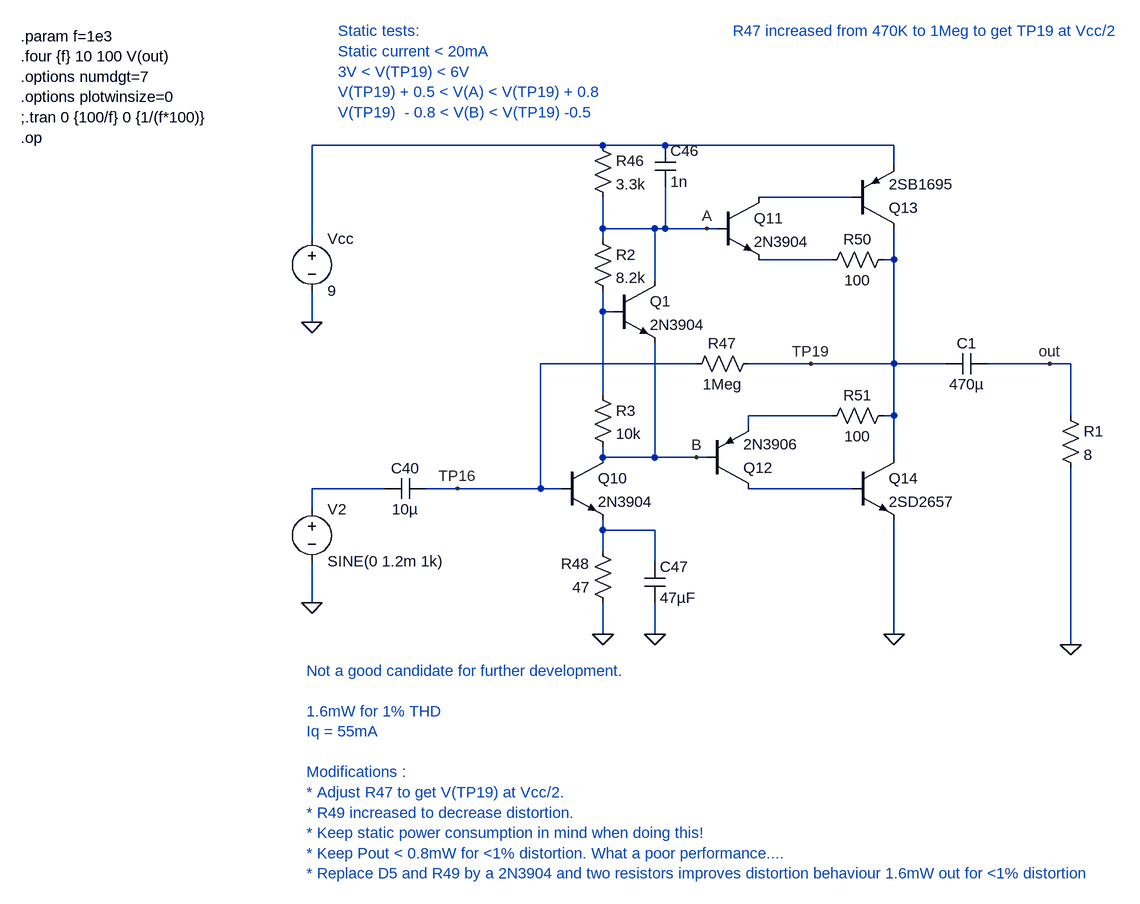
[diagram p0: schematic elenco_speaker_amp.asc]
elenco_speaker_amp.asc, the LTspice schematic file:
Version 4
SHEET 1 1332 1008
WIRE 48 -176 -400 -176
WIRE 144 -176 48 -176
WIRE 496 -176 144 -176
WIRE 496 -144 496 -176
WIRE 432 -96 288 -96
WIRE 48 -48 48 -96
WIRE 128 -48 48 -48
WIRE 144 -48 144 -112
WIRE 144 -48 128 -48
WIRE 208 -48 144 -48
WIRE 224 -48 208 -48
WIRE -400 -32 -400 -176
WIRE 48 -32 48 -48
WIRE 400 0 288 0
WIRE 496 0 496 -48
WIRE 496 0 480 0
WIRE 128 32 128 -48
WIRE 48 80 48 48
WIRE 64 80 48 80
WIRE -400 96 -400 48
WIRE 192 160 -48 160
WIRE 368 160 272 160
WIRE 496 160 496 0
WIRE 496 160 368 160
WIRE 576 160 496 160
WIRE 736 160 640 160
WIRE 768 160 736 160
WIRE 48 208 48 80
WIRE 400 240 272 240
WIRE 496 240 496 160
WIRE 496 240 480 240
WIRE 768 240 768 160
WIRE 272 256 272 240
WIRE 48 304 48 288
WIRE 128 304 128 128
WIRE 128 304 48 304
WIRE 192 304 128 304
WIRE 208 304 192 304
WIRE 496 304 496 240
WIRE -288 352 -400 352
WIRE -176 352 -224 352
WIRE -48 352 -48 160
WIRE -48 352 -176 352
WIRE -16 352 -48 352
WIRE 432 352 272 352
WIRE -400 384 -400 352
WIRE 48 416 48 400
WIRE 128 416 48 416
WIRE 48 448 48 416
WIRE 128 464 128 416
WIRE -400 528 -400 464
WIRE 48 576 48 528
WIRE 128 576 128 528
WIRE 496 576 496 400
WIRE 768 592 768 320
FLAG -400 96 0
FLAG -400 528 0
FLAG 48 576 0
FLAG 128 576 0
FLAG 496 576 0
FLAG -176 352 TP16
FLAG 368 160 TP19
FLAG 208 -48 A
FLAG 192 304 B
FLAG 768 592 0
FLAG 736 160 out
SYMBOL npn 224 -96 R0
SYMATTR InstName Q11
SYMATTR Value 2N3904
SYMBOL npn -16 304 R0
SYMATTR InstName Q10
SYMATTR Value 2N3904
SYMBOL npn 432 304 R0
SYMATTR InstName Q14
SYMATTR Value 2SD2657
SYMBOL pnp 432 -48 M180
SYMATTR InstName Q13
SYMATTR Value 2SB1695
SYMBOL pnp 208 352 M180
SYMATTR InstName Q12
SYMATTR Value 2N3906
SYMBOL res 496 -16 R90
WINDOW 0 0 56 VBottom 2
WINDOW 3 32 56 VTop 2
SYMATTR InstName R50
SYMATTR Value 100
SYMBOL res 496 224 R90
WINDOW 0 0 56 VBottom 2
WINDOW 3 32 56 VTop 2
SYMATTR InstName R51
SYMATTR Value 100
SYMBOL voltage -400 -48 R0
SYMATTR InstName Vcc
SYMATTR Value 9
SYMBOL voltage -400 368 R0
WINDOW 123 0 0 Left 0
WINDOW 39 0 0 Left 0
SYMATTR InstName V2
SYMATTR Value SINE(0 1.2m 1k)
SYMBOL res 32 -192 R0
SYMATTR InstName R46
SYMATTR Value 3.3k
SYMBOL cap 128 -176 R0
SYMATTR InstName C46
SYMATTR Value 1n
SYMBOL res 288 144 R90
WINDOW 0 0 56 VBottom 2
WINDOW 3 32 56 VTop 2
SYMATTR InstName R47
SYMATTR Value 1Meg
SYMBOL res 64 544 R180
WINDOW 0 36 76 Left 2
WINDOW 3 36 40 Left 2
SYMATTR InstName R48
SYMATTR Value 47
SYMBOL cap 112 464 R0
SYMATTR InstName C47
SYMATTR Value 47µF
SYMBOL cap -224 336 R90
WINDOW 0 0 32 VBottom 2
WINDOW 3 32 32 VTop 2
SYMATTR InstName C40
SYMATTR Value 10µ
SYMBOL res 752 224 R0
SYMATTR InstName R1
SYMATTR Value 8
SYMBOL cap 640 144 R90
WINDOW 0 0 32 VBottom 2
WINDOW 3 32 32 VTop 2
SYMATTR InstName C1
SYMATTR Value 470µ
SYMBOL npn 64 32 R0
SYMATTR InstName Q1
SYMATTR Value 2N3904
SYMBOL res 32 -48 R0
SYMATTR InstName R2
SYMATTR Value 8.2k
SYMBOL res 32 192 R0
SYMATTR InstName R3
SYMATTR Value 10k
TEXT -360 -352 Left 2 ;Static tests:\nStatic current < 20mA\n3V < V(TP19) < 6V\nV(TP19) + 0.5 < V(A) < V(TP19) + 0.8\nV(TP19)  - 0.8 < V(B) < V(TP19) -0.5
TEXT 248 -352 Left 2 ;R47 increased from 470K to 1Meg to get TP19 at Vcc/2
TEXT -848 -344 Left 2 !.param f=1e3\n.four {f} 10 100 V(out)\n.options numdgt=7\n.options plotwinsize=0\n;.tran 0 {100/f} 0 {1/(f*100)}\n.op
TEXT -408 632 Left 2 ;Not a good candidate for further development.\n \n1.6mW for 1% THD \nIq = 55mA\n \nModifications : \n* Adjust R47 to get V(TP19) at Vcc/2.\n* R49 increased to decrease distortion.  \n* Keep static power consumption in mind when doing this!\n* Keep Pout < 0.8mW for <1% distortion. What a poor performance....\n* Replace D5 and R49 by a 2N3904 and two resistors improves distortion behaviour 1.6mW out for <1% distortion

The netlist it stands for:
* elenco_speaker_amp.asc
Q11 N002 A N003 0 2N3904
Q10 B TP16 N008 0 2N3904
Q14 TP19 N007 0 0 2SD2657
Q13 TP19 N002 N001 0 2SB1695
Q12 N007 B N005 0 2N3906
R50 TP19 N003 100
R51 TP19 N005 100
Vcc N001 0 9
V2 N006 0 SINE(0 1.2m 1k)
R46 N001 A 3.3k
C46 N001 A 1n
R47 TP19 TP16 1Meg
R48 0 N008 47
C47 N008 0 47µF
C40 TP16 N006 10µ
R1 out 0 8
C1 out TP19 470µ
Q1 A N004 B 0 2N3904
R2 A N004 8.2k
R3 N004 B 10k
.model NPN NPN
.model PNP PNP
.lib standard.bjt
* Static tests:
* Static current < 20mA
* 3V < V(TP19) < 6V
* V(TP19) + 0.5 < V(A) < V(TP19) + 0.8
* V(TP19)  - 0.8 < V(B) < V(TP19) -0.5
* R47 increased from 470K to 1Meg to get TP19 at Vcc/2
.param f=1e3
.four {f} 10 100 V(out)
.options numdgt=7
.options plotwinsize=0
;.tran 0 {100/f} 0 {1/(f*100)}
.op
* Not a good candidate for further development.
* 1.6mW for 1% THD
* Iq = 55mA
* Modifications :
* * Adjust R47 to get V(TP19) at Vcc/2.
* * R49 increased to decrease distortion.
* * Keep static power consumption in mind when doing this!
* * Keep Pout < 0.8mW for <1% distortion. What a poor performance....
* * Replace D5 and R49 by a 2N3904 and two resistors improves distortion behaviour 1.6mW out for <1% distortion
.backanno
.end